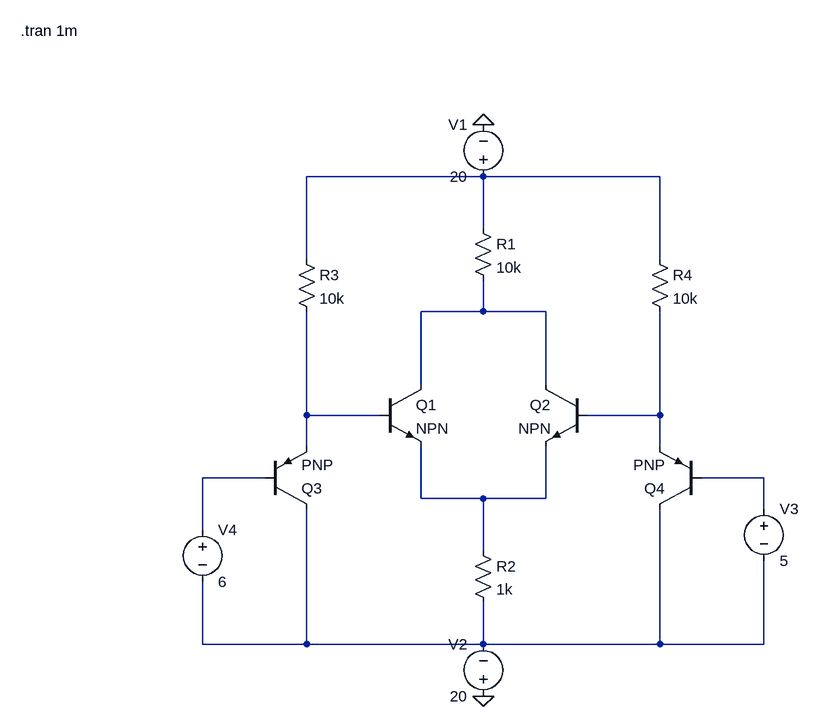
[diagram p0: schematic LlaveElectronica.asc]
LlaveElectronica.asc, the LTspice schematic file:
Version 4
SHEET 1 880 680
WIRE 224 -192 -48 -192
WIRE 496 -192 224 -192
WIRE 224 -112 224 -192
WIRE -48 -64 -48 -192
WIRE 496 -64 496 -192
WIRE 224 16 224 -32
WIRE 224 16 128 16
WIRE 320 16 224 16
WIRE 128 128 128 16
WIRE 320 128 320 16
WIRE -48 176 -48 16
WIRE 64 176 -48 176
WIRE 496 176 496 16
WIRE 496 176 384 176
WIRE -48 224 -48 176
WIRE 496 224 496 176
WIRE -112 272 -208 272
WIRE 656 272 560 272
WIRE 128 304 128 224
WIRE 224 304 128 304
WIRE 320 304 320 224
WIRE 320 304 224 304
WIRE 656 320 656 272
WIRE -208 352 -208 272
WIRE 224 384 224 304
WIRE -208 528 -208 432
WIRE -48 528 -48 320
WIRE -48 528 -208 528
WIRE 224 528 224 464
WIRE 224 528 -48 528
WIRE 496 528 496 320
WIRE 496 528 224 528
WIRE 656 528 656 400
WIRE 656 528 496 528
FLAG 224 608 0
FLAG 224 -272 0
SYMBOL npn 64 128 R0
SYMATTR InstName Q1
SYMBOL npn 384 128 M0
SYMATTR InstName Q2
SYMBOL pnp -112 320 M180
SYMATTR InstName Q3
SYMBOL pnp 560 320 R180
SYMATTR InstName Q4
SYMBOL res 208 -128 R0
SYMATTR InstName R1
SYMATTR Value 10k
SYMBOL res 208 368 R0
SYMATTR InstName R2
SYMATTR Value 1k
SYMBOL voltage 224 -176 R180
WINDOW 0 24 96 Left 2
WINDOW 3 24 16 Left 2
WINDOW 123 0 0 Left 0
WINDOW 39 0 0 Left 0
SYMATTR InstName V1
SYMATTR Value 20
SYMBOL voltage 224 624 R180
WINDOW 0 24 96 Left 2
WINDOW 3 24 16 Left 2
WINDOW 123 0 0 Left 0
WINDOW 39 0 0 Left 0
SYMATTR InstName V2
SYMATTR Value 20
SYMBOL res -64 -80 R0
SYMATTR InstName R3
SYMATTR Value 10k
SYMBOL res 480 -80 R0
SYMATTR InstName R4
SYMATTR Value 10k
SYMBOL voltage 656 304 R0
WINDOW 123 0 0 Left 0
WINDOW 39 0 0 Left 0
SYMATTR InstName V3
SYMATTR Value 5
SYMBOL voltage -208 336 R0
WINDOW 123 0 0 Left 0
WINDOW 39 0 0 Left 0
SYMATTR InstName V4
SYMATTR Value 6
TEXT -488 -416 Left 2 !.tran 1m

The netlist it stands for:
* LlaveElectronica.asc
Q1 N002 N003 N007 0 NPN
Q2 N002 N004 N007 0 NPN
Q3 N008 N005 N003 0 PNP
Q4 N008 N006 N004 0 PNP
R1 N001 N002 10k
R2 N007 N008 1k
V1 N001 0 20
V2 0 N008 20
R3 N001 N003 10k
R4 N001 N004 10k
V3 N006 N008 5
V4 N005 N008 6
.model NPN NPN
.model PNP PNP
.lib standard.bjt
.tran 1m
.backanno
.end